# Altium schematic sheet SDMMC_SDCARD.SchDoc
size A4; SheetNumber: 3; SheetTotal: 9
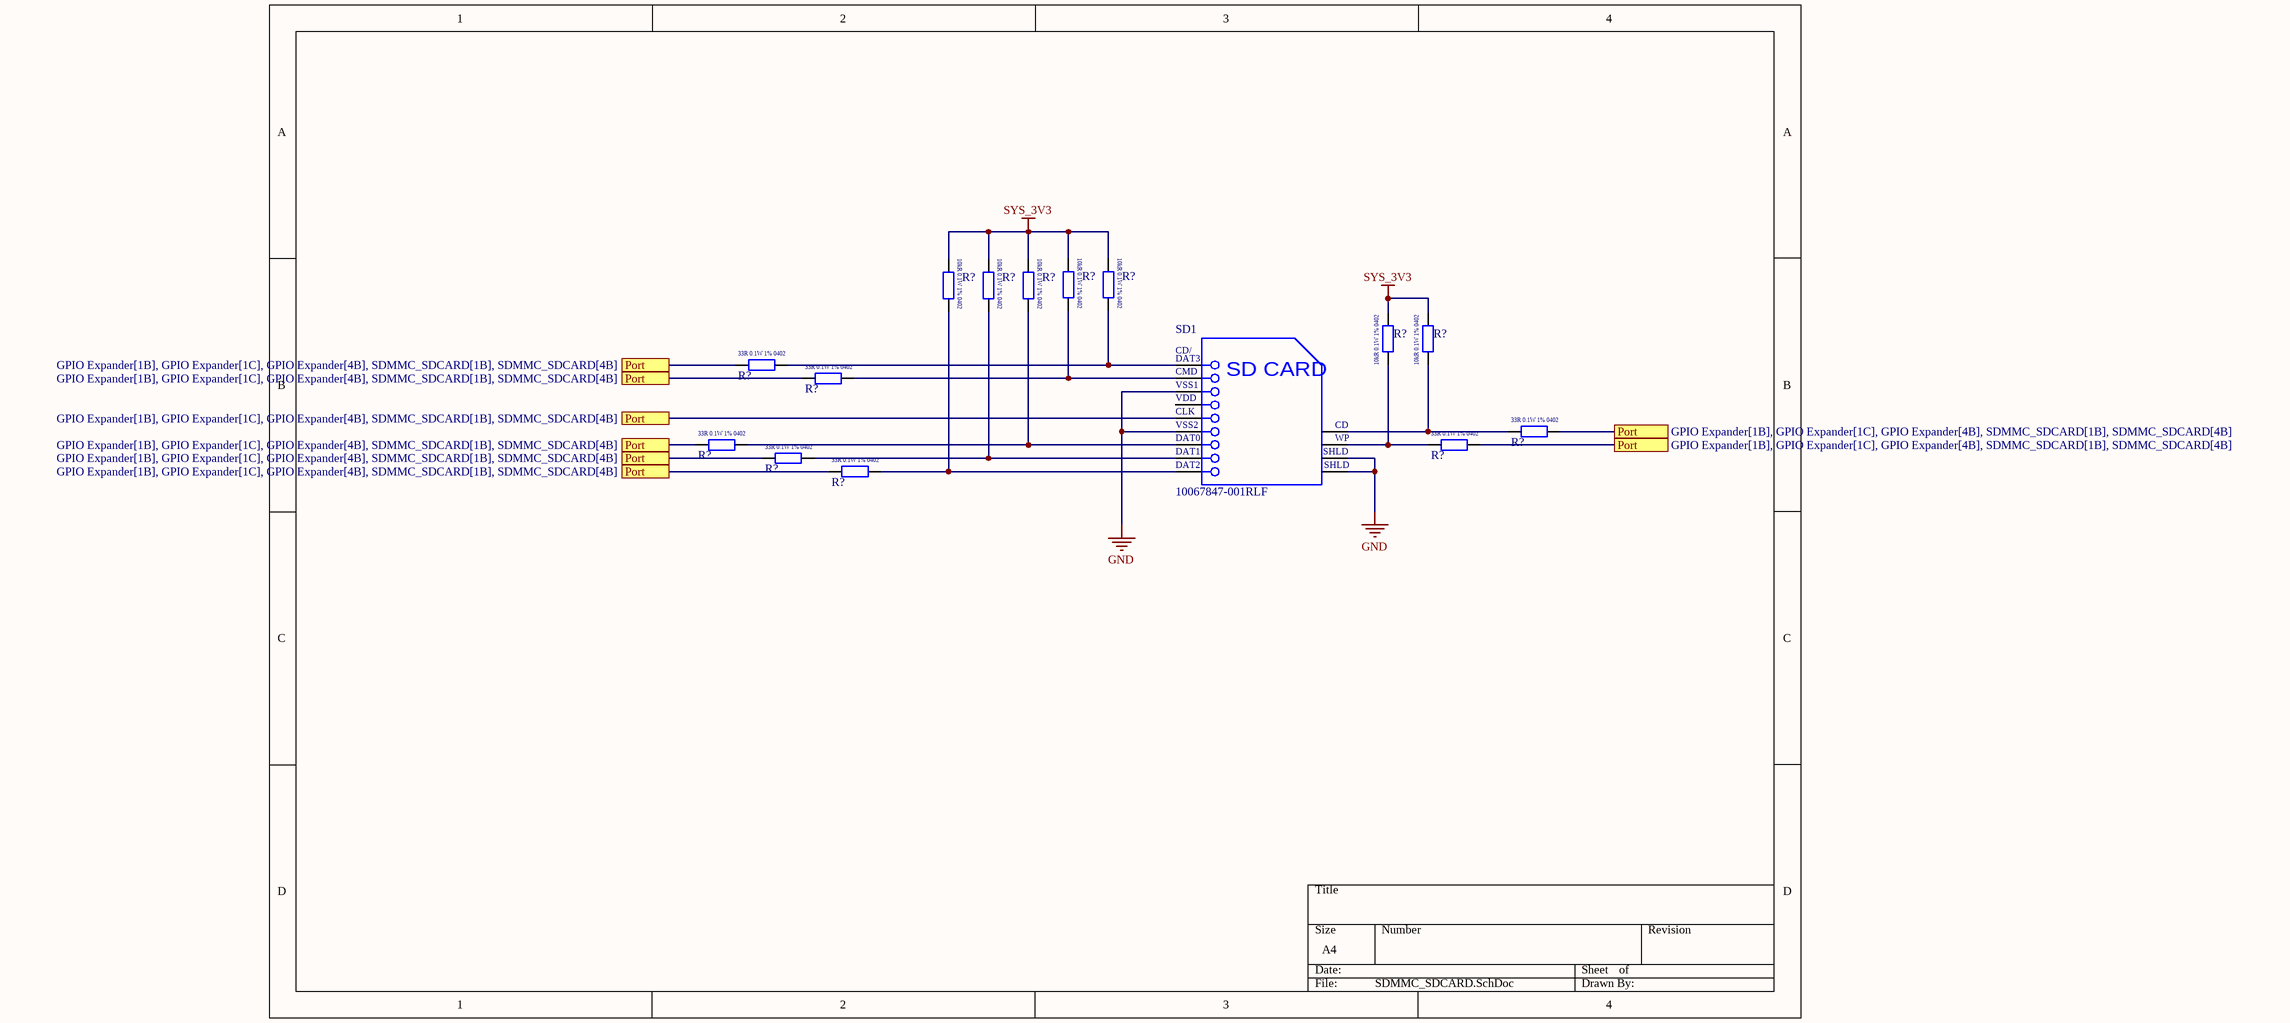
[diagram p0: SDMMC_SDCARD.SchDoc]

## Parts
(Parts that share a designator on the sheet are numbered #1, #2 ... from top to bottom, then left to right.)
R?#1  RK73H1ETTP1002F  [RESC1005X04N]  (value not drawn)
R?#2  RK73H1ETTP1002F  [RESC1005X04N]  (value not drawn)
R?#3  RK73H1ETTP1002F  [RESC1005X04N]  (value not drawn)
R?#4  RK73H1ETTP1002F  [RESC1005X04N]  (value not drawn)
R?#5  RK73H1ETTP1002F  [RESC1005X04N]  (value not drawn)
R?#6  RK73H1ETTP1002F  [RESC1005X04N]  (value not drawn)
R?#7  RK73H1ETTP1002F  [RESC1005X04N]  (value not drawn)
R?#8  ERJ-2RKF33R0X  [RESC1005X04L]  (value not drawn)
R?#9  ERJ-2RKF33R0X  [RESC1005X04L]  (value not drawn)
R?#10  ERJ-2RKF33R0X  [RESC1005X04L]  (value not drawn)
R?#11  ERJ-2RKF33R0X  [RESC1005X04L]  (value not drawn)
R?#12  ERJ-2RKF33R0X  [RESC1005X04L]  (value not drawn)
R?#13  ERJ-2RKF33R0X  [RESC1005X04L]  (value not drawn)
R?#14  ERJ-2RKF33R0X  [RESC1005X04L]  (value not drawn)
SD1  10067847-001RLF  [FCI-10067847-001RLF_V]

## Ports
Port (see GPIO Expander[1B], GPIO Expander[1C], GPIO Expander[4B], SDMMC_SDCARD[1B], SDMMC_SDCARD[4B])

## Nets
GND: SD1.3(VSS1) SD1.6(VSS2) SD1.12(SHLD1) SD1.13(SHLD2)
SYS_3V3: R?#1.1 R?#2.1 R?#3.1 R?#4.1 R?#5.1 R?#6.2 R?#7.2
Port: R?#8.1 R?#9.1 R?#10.2 R?#11.1 R?#12.2 R?#13.1 R?#14.1 SD1.5(CLK) ; port Port
NetR?#1_2: R?#1.2 R?#14.2 SD1.9(DAT2)
NetR?#2_2: R?#2.2 R?#13.2 SD1.8(DAT1)
NetR?#3_2: R?#3.2 R?#11.2 SD1.7(DAT0)
NetR?#4_2: R?#4.2 R?#9.2 SD1.2(CMD)
NetR?#5_2: R?#5.2 R?#8.2 SD1.1(CD/DAT3)
NetR?#6_1: R?#6.1 R?#12.1 SD1.11(WP)
NetR?#7_1: R?#7.1 R?#10.1 SD1.10(CD)

Not connected (* = marked no-connect by the designer): SD1 4(VDD)

## Notes on the sheet
- (in symbol CMP-2000-05818-1) CD/; DAT3; SD CARD; SHLD
- (in symbol ERJ-2RKF33R0X) 33R 0.1W 1% 0402
- (in symbol RK73H1ETTP1002F) 10kR 0.1W 1% 0402

## Library data of the parts
R?#1-R?#7 = RK73H1ETTP1002F: 10 kOhms ±1% 0.1W, 1/10W Chip Resistor 0402 (1005 Metric) Automotive AEC-Q200 Thick Film
R?#8-R?#14 = ERJ-2RKF33R0X: 33 Ohms ±1% 0.1W, 1/10W Chip Resistor 0402 (1005 Metric) Automotive AEC-Q200 Thick Film
SD1 = CMP-2000-05818-1: Assembly SD Card Reader, Famale, 11 Way, -40 to 105 degC, RoHS, Tape and Reel; Manufacturer: FCI Electronics; SVHC: NoSVHC(15-Jun-2015); Connector Type: MemoryCard; No. of Contacts: 11Contacts; Datasheet Version: Rev. K, 09/2014; Datasheet URL: https://datasheet.ciiva.com/1106/10067847-1106690.pdf; Package Reference: 10067847-001RLF; Product Range: -; Contact Material: CopperAlloy; Contact Plating: GoldPlatedContacts; Package Description: 11-Pin Surface Mount Device, Body 29 x 28.5 mm; Mounting Technology: SurfaceMount; Manufacturer URL: http://portal.fciconnect.com/